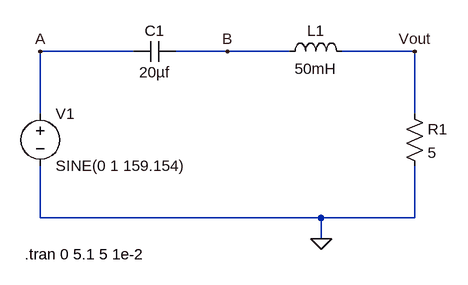
[diagram p0: schematic exercise1_assignment3.asc]
exercise1_assignment3.asc, the LTspice schematic file:
Version 4
SHEET 1 880 680
WIRE 144 32 0 32
WIRE 288 32 208 32
WIRE 384 32 288 32
WIRE 576 32 464 32
WIRE 0 128 0 32
WIRE 576 128 576 32
WIRE 0 288 0 208
WIRE 432 288 0 288
WIRE 576 288 576 208
WIRE 576 288 432 288
WIRE 432 320 432 288
FLAG 432 320 0
FLAG 0 32 A
FLAG 288 32 B
FLAG 576 32 Vout
SYMBOL voltage 0 112 R0
WINDOW 123 0 0 Left 0
WINDOW 39 0 0 Left 0
SYMATTR InstName V1
SYMATTR Value SINE(0 1 159.154)
SYMBOL cap 208 16 R90
WINDOW 0 0 32 VBottom 2
WINDOW 3 32 32 VTop 2
SYMATTR InstName C1
SYMATTR Value 20µf
SYMBOL ind 368 48 R270
WINDOW 0 32 56 VTop 2
WINDOW 3 5 56 VBottom 2
SYMATTR InstName L1
SYMATTR Value 50mH
SYMBOL res 560 112 R0
SYMATTR InstName R1
SYMATTR Value 5
TEXT -24 344 Left 2 !.tran 0 5.1 5 1e-2

The netlist it stands for:
* exercise1_assignment3.asc
V1 A 0 SINE(0 1 159.154)
C1 B A 20µf
L1 B Vout 50mH
R1 Vout 0 5
.tran 0 5.1 5 1e-2
.backanno
.end